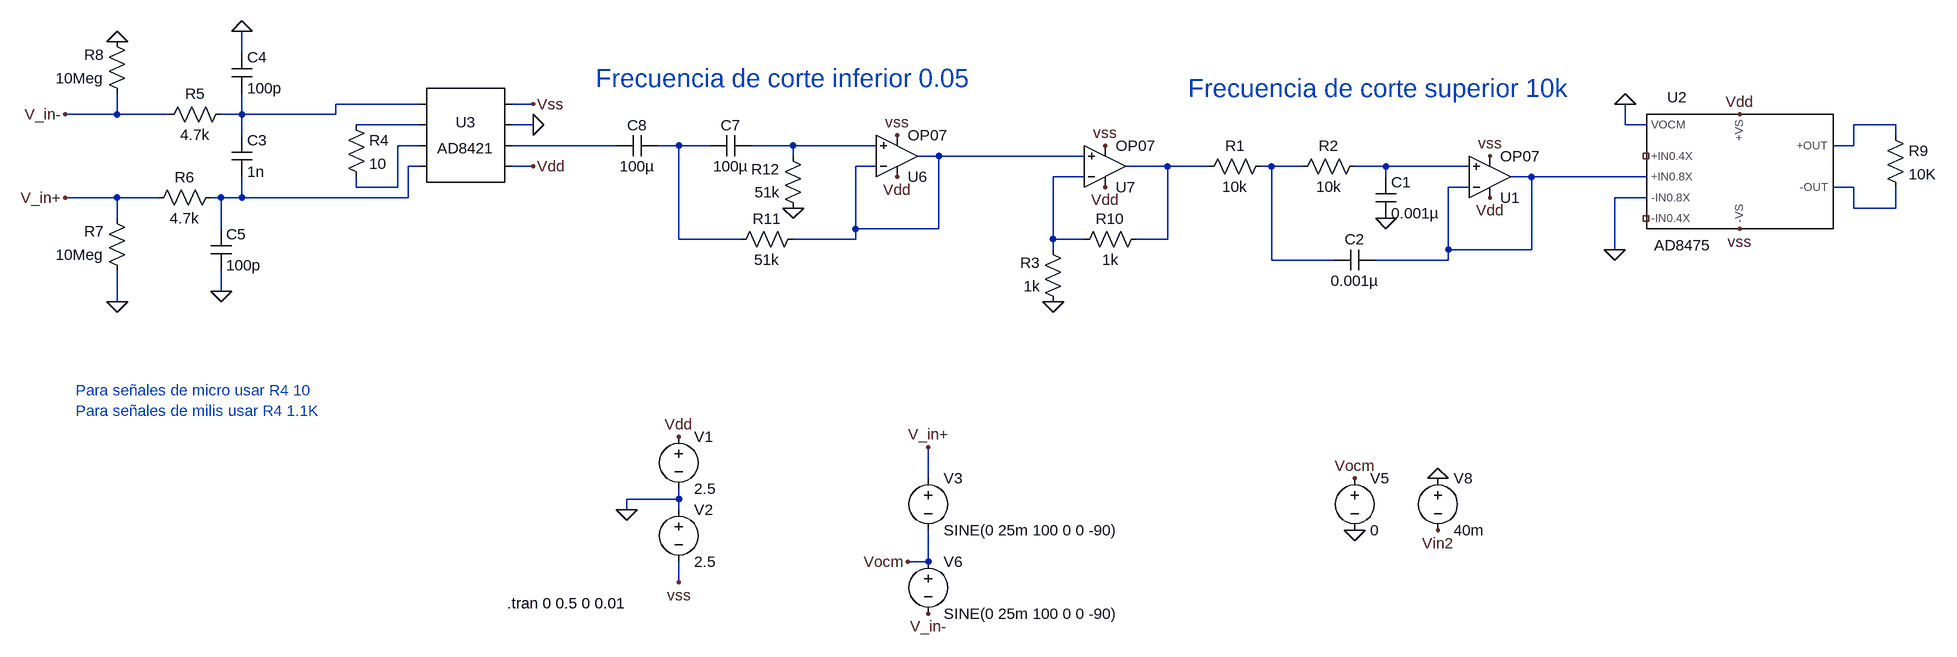
[diagram p0: schematic EEG_complete_tran.asc]
EEG_complete_tran.asc, the LTspice schematic file:
Version 4
SHEET 1 2376 1224
WIRE -1600 16 -1600 -16
WIRE -1328 96 -1456 96
WIRE -1152 96 -1184 96
WIRE -1792 112 -1792 80
WIRE -1792 112 -1872 112
WIRE -1712 112 -1792 112
WIRE -1600 112 -1600 80
WIRE -1600 112 -1632 112
WIRE -1456 112 -1456 96
WIRE -1456 112 -1600 112
WIRE -1328 128 -1424 128
WIRE -1152 128 -1184 128
WIRE 528 128 528 96
WIRE 560 128 528 128
WIRE 944 128 880 128
WIRE -1600 144 -1600 112
WIRE 944 144 944 128
WIRE -1328 160 -1360 160
WIRE -1024 160 -1184 160
WIRE -928 160 -960 160
WIRE -880 160 -928 160
WIRE -752 160 -816 160
WIRE -624 160 -752 160
WIRE 880 160 880 128
WIRE 880 160 848 160
WIRE -752 176 -752 160
WIRE -528 176 -560 176
WIRE -304 176 -528 176
WIRE -1328 192 -1344 192
WIRE -1152 192 -1184 192
WIRE -624 192 -656 192
WIRE -176 192 -240 192
WIRE -112 192 -176 192
WIRE -16 192 -32 192
WIRE 32 192 -16 192
WIRE 160 192 112 192
WIRE 288 192 160 192
WIRE -304 208 -352 208
WIRE 160 208 160 192
WIRE 384 208 352 208
WIRE 560 208 384 208
WIRE -1424 224 -1424 208
WIRE -1360 224 -1360 160
WIRE -1360 224 -1424 224
WIRE 288 224 256 224
WIRE 880 224 848 224
WIRE -1792 240 -1872 240
WIRE -1728 240 -1792 240
WIRE -1632 240 -1648 240
WIRE -1600 240 -1600 208
WIRE -1600 240 -1632 240
WIRE -1344 240 -1344 192
WIRE -1344 240 -1600 240
WIRE 560 240 512 240
WIRE 880 256 880 224
WIRE 944 256 944 224
WIRE 944 256 880 256
WIRE -1792 272 -1792 240
WIRE -1632 288 -1632 240
WIRE -656 288 -656 192
WIRE -528 288 -528 176
WIRE -528 288 -656 288
WIRE -928 304 -928 160
WIRE -832 304 -928 304
WIRE -656 304 -656 288
WIRE -656 304 -752 304
WIRE -352 304 -352 208
WIRE -304 304 -352 304
WIRE -176 304 -176 192
WIRE -176 304 -224 304
WIRE -352 320 -352 304
WIRE 256 320 256 224
WIRE 384 320 384 208
WIRE 384 320 256 320
WIRE 512 320 512 240
WIRE -16 336 -16 192
WIRE 80 336 -16 336
WIRE 256 336 256 320
WIRE 256 336 144 336
WIRE -1632 384 -1632 352
WIRE -1792 400 -1792 352
WIRE -544 672 -544 624
WIRE -928 704 -928 688
WIRE -928 704 -1008 704
WIRE -1008 720 -1008 704
WIRE -928 720 -928 704
WIRE -544 800 -544 752
WIRE -544 800 -576 800
WIRE -928 832 -928 800
FLAG 160 272 0
FLAG 320 176 vss
FLAG 320 240 Vdd
FLAG -928 608 Vdd
FLAG -928 832 vss
FLAG 704 288 vss
FLAG 704 112 Vdd
FLAG -544 624 V_in+
FLAG -1872 240 V_in+
FLAG -1152 96 Vss
FLAG -1152 192 Vdd
FLAG -1632 384 0
FLAG -1600 -16 0
FLAG -1792 0 0
FLAG -1792 400 0
FLAG -1872 112 V_in-
FLAG -1008 720 0
FLAG 112 752 0
FLAG 112 672 Vocm
FLAG -544 880 V_in-
FLAG -576 800 Vocm
FLAG 240 672 0
FLAG 240 752 Vin2
FLAG -752 256 0
FLAG -592 144 vss
FLAG -592 208 Vdd
FLAG -272 160 vss
FLAG -272 224 Vdd
FLAG -352 400 0
FLAG -1152 128 0
FLAG 528 96 0
FLAG 512 320 0
SYMBOL voltage -928 592 R0
WINDOW 123 0 0 Left 2
WINDOW 39 0 0 Left 2
SYMATTR InstName V1
SYMATTR Value 2.5
SYMBOL voltage -928 704 R0
WINDOW 123 0 0 Left 2
WINDOW 39 0 0 Left 2
SYMATTR InstName V2
SYMATTR Value 2.5
SYMBOL voltage -544 656 R0
WINDOW 123 0 0 Left 2
WINDOW 39 0 0 Left 2
SYMATTR InstName V3
SYMATTR Value SINE(0 25m 100 0 0 -90)
SYMBOL Opamps\\OP07 320 272 M180
SYMATTR InstName U1
SYMBOL AutoGenerated\\AD8475 800 192 R0
SYMATTR InstName U2
SYMBOL res -16 176 R90
WINDOW 0 0 56 VBottom 2
WINDOW 3 32 56 VTop 2
SYMATTR InstName R1
SYMATTR Value 10k
SYMBOL res 128 176 R90
WINDOW 0 0 56 VBottom 2
WINDOW 3 32 56 VTop 2
SYMATTR InstName R2
SYMATTR Value 10k
SYMBOL cap 144 208 R0
SYMATTR InstName C1
SYMATTR Value 0.001µ
SYMBOL cap 144 320 R90
WINDOW 0 0 32 VBottom 2
WINDOW 3 32 32 VTop 2
SYMATTR InstName C2
SYMATTR Value 0.001µ
SYMBOL AutoGenerated\\AD8421 -1264 144 R0
SYMATTR InstName U3
SYMBOL res -1440 112 R0
SYMATTR InstName R4
SYMATTR Value 10
SYMBOL res -1616 96 R90
WINDOW 0 0 56 VBottom 2
WINDOW 3 32 56 VTop 2
SYMATTR InstName R5
SYMATTR Value 4.7k
SYMBOL res -1632 224 R90
WINDOW 0 0 56 VBottom 2
WINDOW 3 32 56 VTop 2
SYMATTR InstName R6
SYMATTR Value 4.7k
SYMBOL res -1776 368 R180
WINDOW 0 36 76 Left 2
WINDOW 3 36 40 Left 2
SYMATTR InstName R7
SYMATTR Value 10Meg
SYMBOL res -1776 96 R180
WINDOW 0 36 76 Left 2
WINDOW 3 36 40 Left 2
SYMATTR InstName R8
SYMATTR Value 10Meg
SYMBOL cap -1616 144 R0
SYMATTR InstName C3
SYMATTR Value 1n
SYMBOL cap -1616 16 R0
SYMATTR InstName C4
SYMATTR Value 100p
SYMBOL cap -1648 288 R0
SYMATTR InstName C5
SYMATTR Value 100p
SYMBOL res 928 128 R0
SYMATTR InstName R9
SYMATTR Value 10K
SYMBOL voltage 112 656 R0
WINDOW 123 0 0 Left 2
WINDOW 39 0 0 Left 2
SYMATTR InstName V5
SYMATTR Value 0
SYMBOL voltage -544 784 R0
WINDOW 123 0 0 Left 2
WINDOW 39 0 0 Left 2
SYMATTR InstName V6
SYMATTR Value SINE(0 25m 100 0 0 -90)
SYMBOL voltage 240 656 R0
WINDOW 123 0 0 Left 2
WINDOW 39 0 0 Left 2
SYMATTR InstName V8
SYMATTR Value 40m
SYMBOL Opamps\\OP07 -592 240 M180
SYMATTR InstName U6
SYMBOL res -736 288 R90
WINDOW 0 0 56 VBottom 2
WINDOW 3 32 56 VTop 2
SYMATTR InstName R11
SYMATTR Value 51k
SYMBOL res -736 272 R180
WINDOW 0 36 76 Left 2
WINDOW 3 36 40 Left 2
SYMATTR InstName R12
SYMATTR Value 51k
SYMBOL cap -816 144 R90
WINDOW 0 0 32 VBottom 2
WINDOW 3 32 32 VTop 2
SYMATTR InstName C7
SYMATTR Value 100µ
SYMBOL cap -960 144 R90
WINDOW 0 0 32 VBottom 2
WINDOW 3 32 32 VTop 2
SYMATTR InstName C8
SYMATTR Value 100µ
SYMBOL Opamps\\OP07 -272 256 M180
SYMATTR InstName U7
SYMBOL res -336 416 R180
WINDOW 0 36 76 Left 2
WINDOW 3 36 40 Left 2
SYMATTR InstName R3
SYMATTR Value 1k
SYMBOL res -208 288 R90
WINDOW 0 0 56 VBottom 2
WINDOW 3 32 56 VTop 2
SYMATTR InstName R10
SYMATTR Value 1k
TEXT -1192 864 Left 2 !.tran 0 0.5 0 0.01
TEXT -1056 56 Left 4 ;Frecuencia de corte inferior 0.05
TEXT -1856 536 Left 2 ;Para señales de micro usar R4 10
TEXT -1856 568 Left 2 ;Para señales de milis usar R4 1.1K
TEXT -144 72 Left 4 ;Frecuencia de corte superior 10k

The netlist it stands for:
* EEG_complete_tran.asc
V1 Vdd 0 2.5
V2 0 vss 2.5
V3 V_in+ Vocm SINE(0 25m 100 0 0 -90)
XU1 N012 N014 Vdd vss N014 LT1001  ; OP07, pins In+ In- V+ V- OUT
XU2 0 NC_01 Vdd 0 N003 N015 vss NC_02 N014 AD8475  ; pins -IN0.8X -IN0.4X +VS VOCM +OUT -OUT -VS +IN0.4X +IN0.8X
R1 N011 N010 10k
R2 N012 N011 10k
C1 N012 0 0.001µ
C2 N014 N011 0.001µ
* U3: AD8421 (symbol AutoGenerated\AD8421 not available, pins judged from their places): pin1=N001 pin2=N002 pin3=N004 pin4=N009 pin5=vss pin6=0 pin7=N005 pin8=Vdd
R4 N002 N004 10
R5 N001 V_in- 4.7k
R6 N009 V_in+ 4.7k
R7 0 V_in+ 10Meg
R8 V_in- 0 10Meg
C3 N001 N009 1n
C4 0 N001 100p
C5 N009 0 100p
R9 N003 N015 10K
V5 Vocm 0 0
V6 Vocm V_in- SINE(0 25m 100 0 0 -90)
V8 0 Vin2 40m
XU6 N007 N008 Vdd vss N008 LT1001  ; OP07, pins In+ In- V+ V- OUT
R11 N008 N006 51k
R12 0 N007 51k
C7 N007 N006 100µ
C8 N006 N005 100µ
XU7 N008 N013 Vdd vss N010 LT1001  ; OP07, pins In+ In- V+ V- OUT
R3 0 N013 1k
R10 N010 N013 1k
.tran 0 0.5 0 0.01
* Frecuencia de corte inferior 0.05
* Para señales de micro usar R4 10
* Para señales de milis usar R4 1.1K
* Frecuencia de corte superior 10k
.lib LTC.lib
.lib C:\users\wac\My Documents\repo\iowlabs\EEG\hardware\simulations\ad8475.cir
.backanno
.end